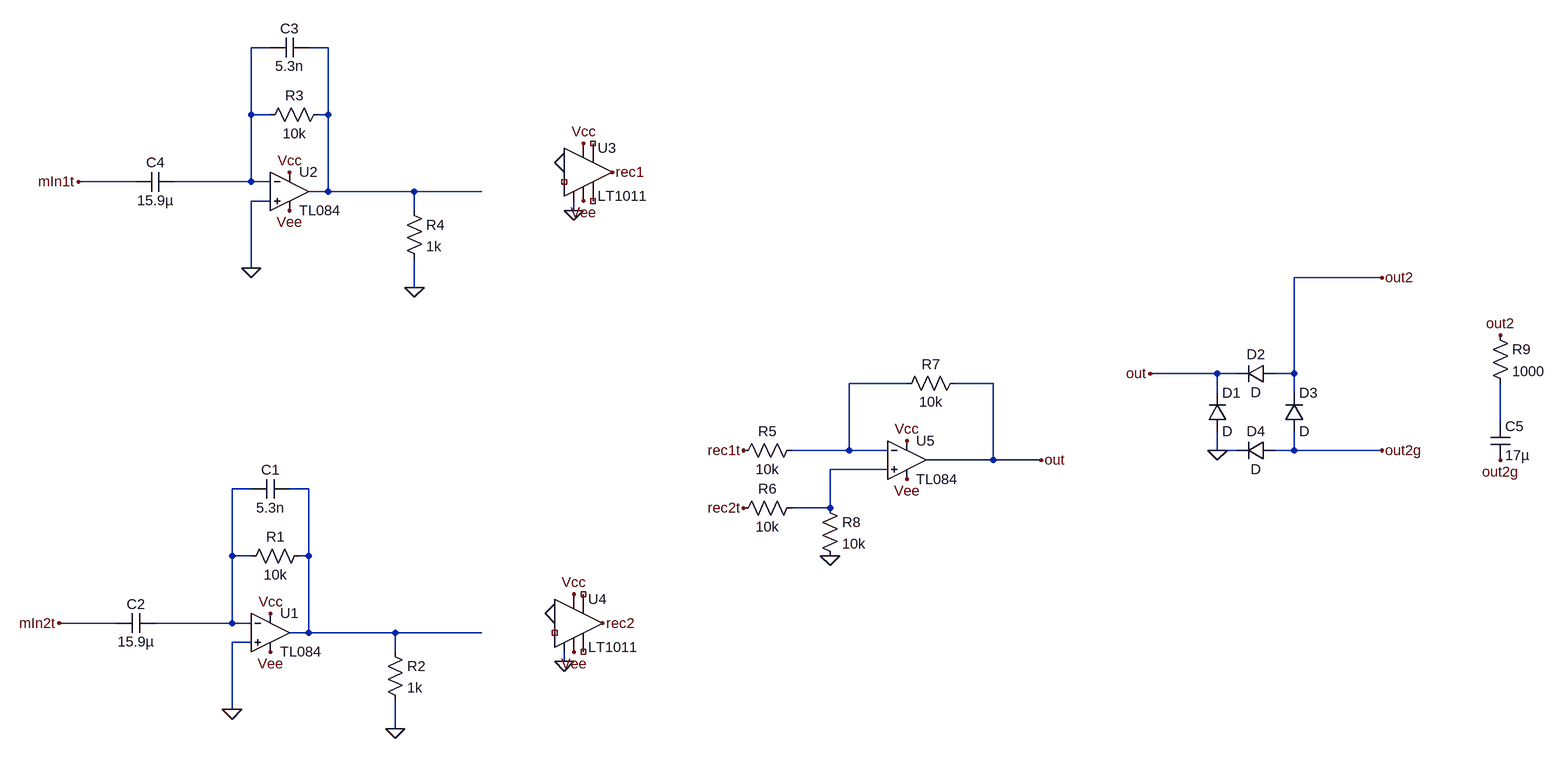
[diagram p0: schematic Draft1.asc]
Draft1.asc, the LTspice schematic file:
Version 4
SHEET 1 3012 680
WIRE -192 -1360 -224 -1360
WIRE -96 -1360 -128 -1360
WIRE -224 -1248 -224 -1360
WIRE -192 -1248 -224 -1248
WIRE -96 -1248 -96 -1360
WIRE -96 -1248 -112 -1248
WIRE -416 -1136 -512 -1136
WIRE -224 -1136 -224 -1248
WIRE -224 -1136 -352 -1136
WIRE -192 -1136 -224 -1136
WIRE -96 -1120 -96 -1248
WIRE -96 -1120 -128 -1120
WIRE 48 -1120 -96 -1120
WIRE 160 -1120 48 -1120
WIRE -192 -1104 -224 -1104
WIRE 48 -1088 48 -1120
WIRE 352 -1088 352 -1104
WIRE -224 -992 -224 -1104
WIRE 2512 -976 2336 -976
WIRE 48 -960 48 -1008
WIRE 2208 -816 2096 -816
WIRE 2240 -816 2208 -816
WIRE 2336 -816 2336 -976
WIRE 2336 -816 2304 -816
WIRE 1632 -800 1536 -800
WIRE 1776 -800 1712 -800
WIRE 2208 -784 2208 -816
WIRE 2336 -784 2336 -816
WIRE 2928 -736 2928 -800
WIRE 1536 -688 1536 -800
WIRE 1536 -688 1440 -688
WIRE 1600 -688 1536 -688
WIRE 2208 -688 2208 -720
WIRE 2240 -688 2208 -688
WIRE 2336 -688 2336 -720
WIRE 2336 -688 2304 -688
WIRE 2512 -688 2336 -688
WIRE 1776 -672 1776 -800
WIRE 1776 -672 1664 -672
WIRE 1856 -672 1776 -672
WIRE 1600 -656 1504 -656
WIRE -224 -624 -256 -624
WIRE -128 -624 -160 -624
WIRE 1504 -592 1504 -656
WIRE 1504 -592 1440 -592
WIRE -256 -512 -256 -624
WIRE -224 -512 -256 -512
WIRE -128 -512 -128 -624
WIRE -128 -512 -144 -512
WIRE -448 -400 -544 -400
WIRE -256 -400 -256 -512
WIRE -256 -400 -384 -400
WIRE -224 -400 -256 -400
WIRE -128 -384 -128 -512
WIRE -128 -384 -160 -384
WIRE 16 -384 -128 -384
WIRE 160 -384 16 -384
WIRE -224 -368 -256 -368
WIRE 16 -352 16 -384
WIRE 336 -336 336 -352
WIRE -256 -256 -256 -368
WIRE 16 -224 16 -272
FLAG -256 -256 0
FLAG 16 -224 0
FLAG -224 -992 0
FLAG 48 -960 0
FLAG -160 -1152 Vcc
FLAG -192 -416 Vcc
FLAG -160 -1088 Vee
FLAG -192 -352 Vee
FLAG 336 -336 0
FLAG 352 -1088 0
FLAG 368 -1200 Vcc
FLAG 352 -448 Vcc
FLAG 368 -1104 Vee
FLAG 352 -352 Vee
FLAG 336 -1168 0
FLAG 320 -416 0
FLAG -512 -1136 mIn1t
FLAG -544 -400 mIn2t
FLAG 416 -1152 rec1
FLAG 400 -400 rec2
FLAG 1632 -704 Vcc
FLAG 1632 -640 Vee
FLAG 1856 -672 out
FLAG 1504 -512 0
FLAG 2512 -976 out2
FLAG 2208 -688 0
FLAG 2096 -816 out
FLAG 2512 -688 out2g
FLAG 2928 -672 out2g
FLAG 2928 -880 out2
FLAG 1360 -688 rec1t
FLAG 1360 -592 rec2t
SYMBOL res -128 -528 R90
WINDOW 0 0 56 VBottom 2
WINDOW 3 32 56 VTop 2
SYMATTR InstName R1
SYMATTR Value 10k
SYMBOL cap -160 -640 R90
WINDOW 0 0 32 VBottom 2
WINDOW 3 32 32 VTop 2
SYMATTR InstName C1
SYMATTR Value 5.3n
SYMBOL cap -384 -416 R90
WINDOW 0 0 32 VBottom 2
WINDOW 3 32 32 VTop 2
SYMATTR InstName C2
SYMATTR Value 15.9µ
SYMBOL Opamps\\opamp2 -192 -448 R0
SYMATTR InstName U1
SYMATTR Value TL084
SYMBOL res 0 -368 R0
SYMATTR InstName R2
SYMATTR Value 1k
SYMBOL res -96 -1264 R90
WINDOW 0 0 56 VBottom 2
WINDOW 3 32 56 VTop 2
SYMATTR InstName R3
SYMATTR Value 10k
SYMBOL cap -128 -1376 R90
WINDOW 0 0 32 VBottom 2
WINDOW 3 32 32 VTop 2
SYMATTR InstName C3
SYMATTR Value 5.3n
SYMBOL cap -352 -1152 R90
WINDOW 0 0 32 VBottom 2
WINDOW 3 32 32 VTop 2
SYMATTR InstName C4
SYMATTR Value 15.9µ
SYMBOL Opamps\\opamp2 -160 -1184 R0
SYMATTR InstName U2
SYMATTR Value TL084
SYMBOL res 32 -1104 R0
SYMATTR InstName R4
SYMATTR Value 1k
SYMBOL Comparators\\LT1011 368 -1152 R0
SYMATTR InstName U3
SYMBOL Comparators\\LT1011 352 -400 R0
SYMATTR InstName U4
SYMBOL Opamps\\opamp2 1632 -736 R0
SYMATTR InstName U5
SYMATTR Value TL084
SYMBOL res 1456 -704 R90
WINDOW 0 0 56 VBottom 2
WINDOW 3 32 56 VTop 2
SYMATTR InstName R5
SYMATTR Value 10k
SYMBOL res 1456 -608 R90
WINDOW 0 0 56 VBottom 2
WINDOW 3 32 56 VTop 2
SYMATTR InstName R6
SYMATTR Value 10k
SYMBOL res 1728 -816 R90
WINDOW 0 0 56 VBottom 2
WINDOW 3 32 56 VTop 2
SYMATTR InstName R7
SYMATTR Value 10k
SYMBOL res 1488 -608 R0
SYMATTR InstName R8
SYMATTR Value 10k
SYMBOL diode 2192 -720 M180
WINDOW 0 24 64 Left 2
WINDOW 3 24 0 Left 2
SYMATTR InstName D1
SYMBOL diode 2304 -800 M270
WINDOW 0 32 32 VTop 2
WINDOW 3 0 32 VBottom 2
SYMATTR InstName D2
SYMBOL diode 2320 -720 M180
WINDOW 0 24 64 Left 2
WINDOW 3 24 0 Left 2
SYMATTR InstName D3
SYMBOL diode 2304 -704 R90
WINDOW 0 0 32 VBottom 2
WINDOW 3 32 32 VTop 2
SYMATTR InstName D4
SYMBOL res 2912 -896 R0
SYMATTR InstName R9
SYMATTR Value 1000
SYMBOL cap 2912 -736 R0
SYMATTR InstName C5
SYMATTR Value 17µ

The netlist it stands for:
* Draft1.asc
R1 N007 N006 10k
C1 N007 N006 5.3n
C2 N006 mIn2t 15.9µ
XU1 0 N006 Vcc Vee N007 TL084  ; pins In+ In- V+ V- OUT
R2 N007 0 1k
R3 N002 N001 10k
C3 N002 N001 5.3n
C4 N001 mIn1t 15.9µ
XU2 0 N001 Vcc Vee N002 TL084  ; pins In+ In- V+ V- OUT
R4 N002 0 1k
XU3 0 NC_01 0 Vee NC_02 NC_03 rec1 Vcc LT1011
XU4 0 NC_04 0 Vee NC_05 NC_06 rec2 Vcc LT1011
XU5 N005 N003 Vcc Vee out TL084  ; pins In+ In- V+ V- OUT
R5 N003 rec1t 10k
R6 N005 rec2t 10k
R7 out N003 10k
R8 N005 0 10k
D1 0 out D
D2 out2 out D
D3 out2g out2 D
D4 out2g 0 D
R9 out2 N004 1000
C5 N004 out2g 17µ
.model D D
.lib standard.dio
.lib LTC1.lib
.backanno
.end